# EAGLE design NT_SolarModule (EAGLE 9.5.1)
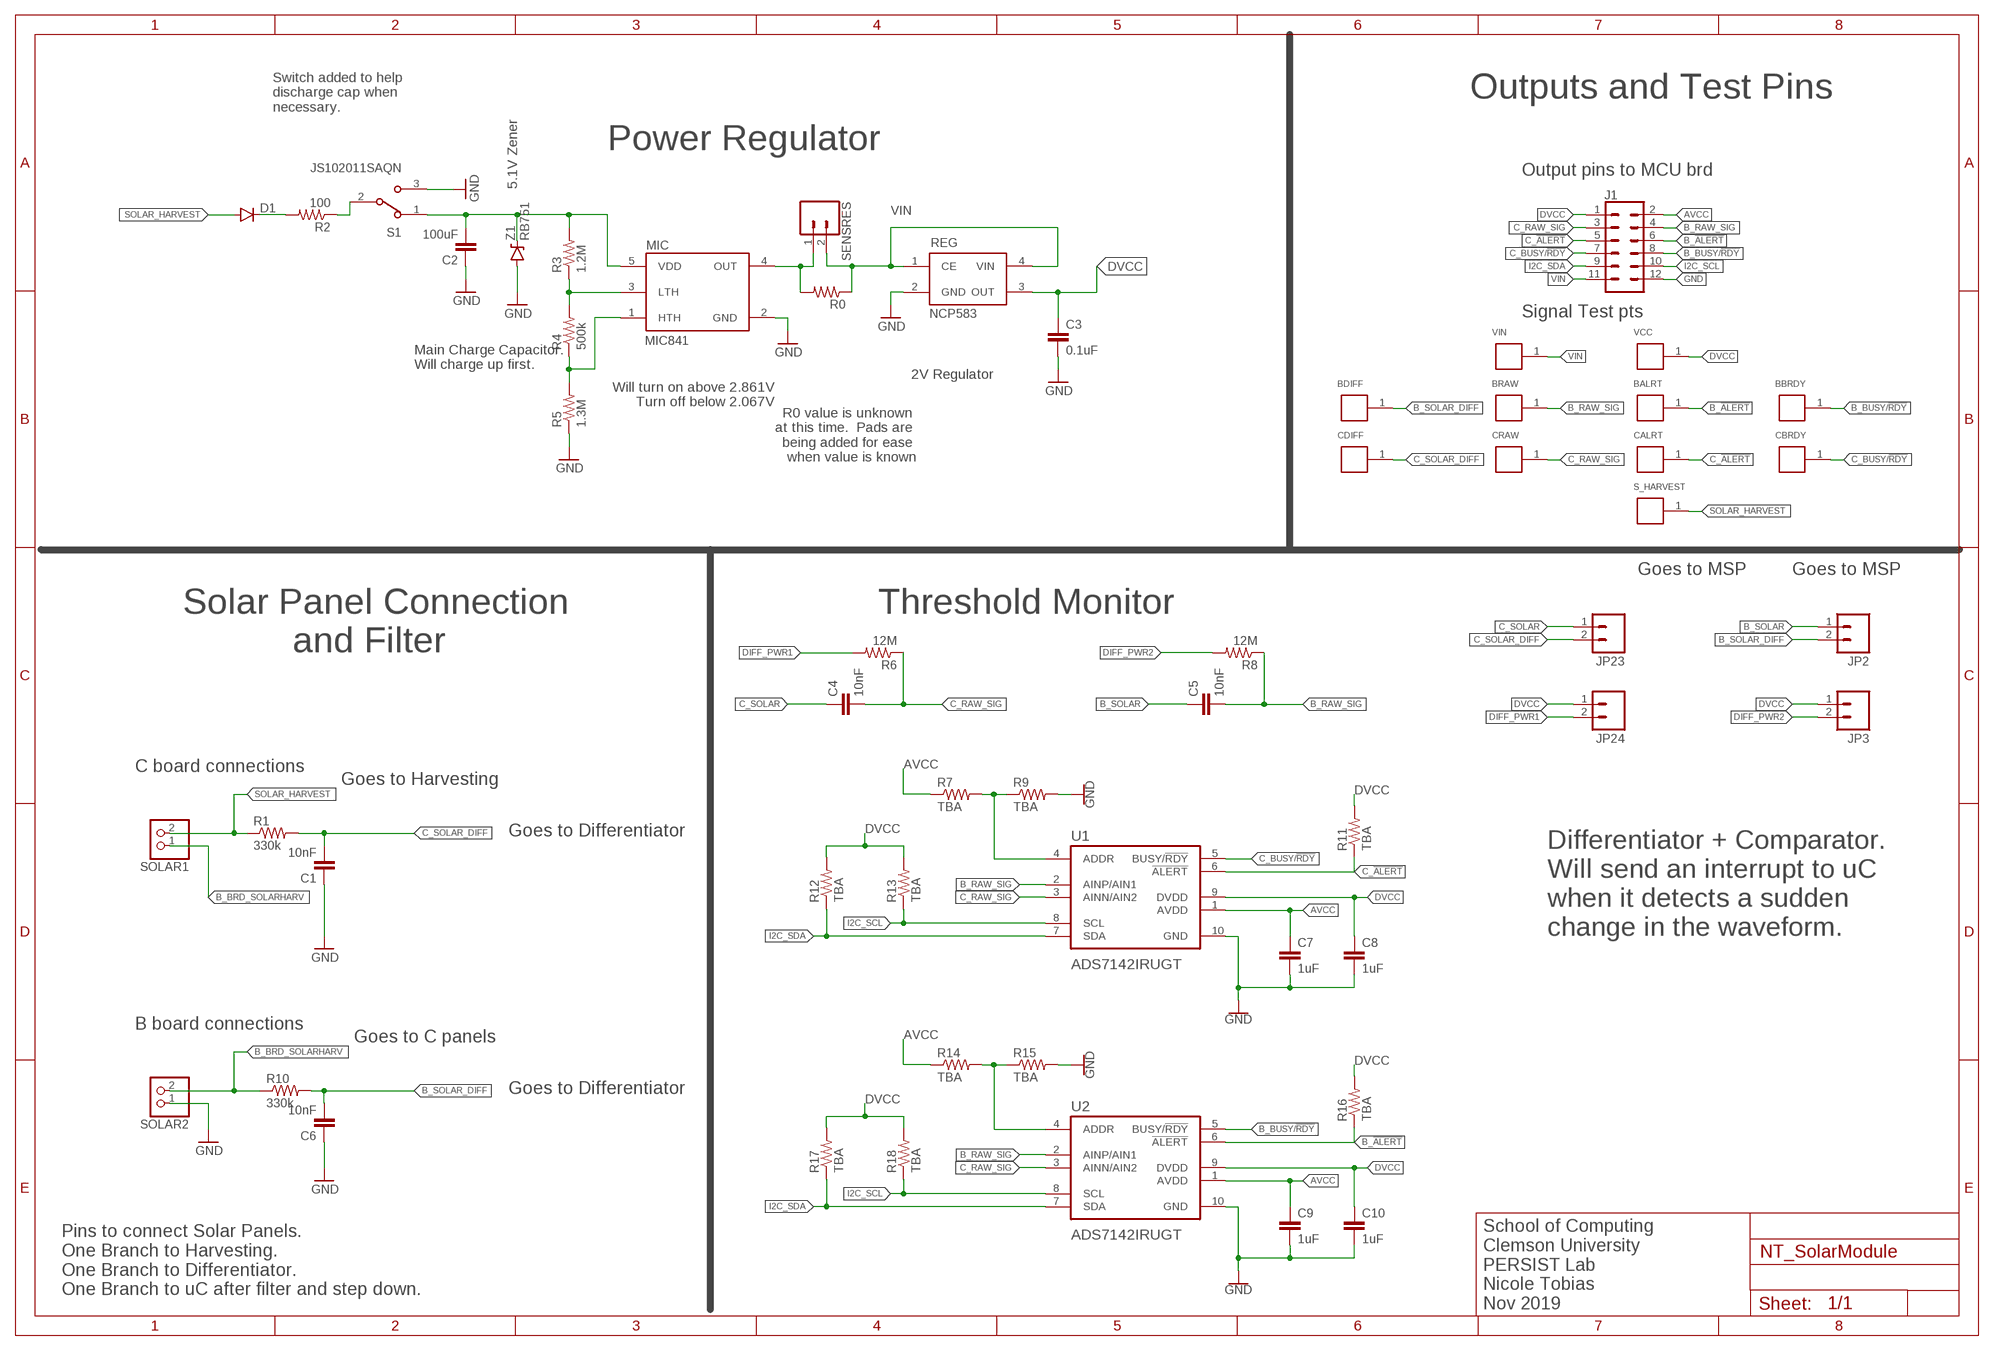
[diagram p0: schematic, sheet 1]

## Parts
BALRT  RCU-0C  [TE_RCU-0C]
BBRDY  RCU-0C  [TE_RCU-0C]
BDIFF  RCU-0C  [TE_RCU-0C]
BRAW  RCU-0C  [TE_RCU-0C]
C1  10nF  CAP0603-CAP  [0603-CAP]
C2  100uF  CAP0603-CAP  [0603-CAP]
C3  0.1uF  CAP0603-CAP  [0603-CAP]
C4  10nF  CAP0603-CAP  [0603-CAP]
C5  10nF  CAP0603-CAP  [0603-CAP]
C6  10nF  CAP0603-CAP  [0603-CAP]
C7  1uF  CAP0603-CAP  [0603-CAP]
C8  1uF  CAP0603-CAP  [0603-CAP]
C9  1uF  CAP0603-CAP  [0603-CAP]
C10  1uF  CAP0603-CAP  [0603-CAP]
CALRT  RCU-0C  [TE_RCU-0C]
CBRDY  RCU-0C  [TE_RCU-0C]
CDIFF  RCU-0C  [TE_RCU-0C]
CRAW  RCU-0C  [TE_RCU-0C]
D1  DIODESOD523  [SOD523]
J1  2X6 FEMALE  CONN_06X2PTH_FEMALE  [2X6]
JP2  M02  [1X02-1.27MM]
JP3  M02  [1X02-1.27MM]
JP23  M02  [1X02-1.27MM]
JP24  M02  [1X02-1.27MM]
MIC  MIC841  [SC70-5]
R0  RESISTOR0603  [0603-RES]
R1  330k  RESISTOR0603  [0603-RES]
R2  100  RESISTOR0603  [0603-RES]
R3  1.2M  RESISTOR0603  [0603-RES]
R4  500k  RESISTOR0603  [0603-RES]
R5  1.3M  RESISTOR0603  [0603-RES]
R6  12M  RESISTOR0603  [0603-RES]
R7  TBA  RESISTOR0603  [0603-RES]
R8  12M  RESISTOR0603  [0603-RES]
R9  TBA  RESISTOR0603  [0603-RES]
R10  330k  RESISTOR0603  [0603-RES]
R11  TBA  RESISTOR0603  [0603-RES]
R12  TBA  RESISTOR0603  [0603-RES]
R13  TBA  RESISTOR0603  [0603-RES]
R14  TBA  RESISTOR0603  [0603-RES]
R15  TBA  RESISTOR0603  [0603-RES]
R16  TBA  RESISTOR0603  [0603-RES]
R17  TBA  RESISTOR0603  [0603-RES]
R18  TBA  RESISTOR0603  [0603-RES]
REG  NCP583  [SC82-AB_1PRIMARY]
S1  JS102011SAQN  [SW_JS102011SAQN]
S_HARVEST  RCU-0C  [TE_RCU-0C]
SENSRES  CONN_02  [1X02]
SOLAR1  PINHD-1X2  [1X02]
SOLAR2  PINHD-1X2  [1X02]
U1  ADS7142IRUGT  [QFN50P200X150X40-10N]
U2  ADS7142IRUGT  [QFN50P200X150X40-10N]
VCC  RCU-0C  [TE_RCU-0C]
VIN  RCU-0C  [TE_RCU-0C]
Z1  RB751  DIODE-ZENER  [SOD-523]

## Nets
AVCC: C7.1 C9.1 J1.2 R7.1 R14.1 U1.1(AVDD) U2.1(AVDD)
B_!ALERT: BALRT.1 J1.6 R16.1 U2.6(!ALERT)
B_BRD_SOLARHARV: R10.1 SOLAR1.1 SOLAR2.2
B_BUSY/!RDY: BBRDY.1 J1.8 U2.5(BUSY/!RDY)
B_RAW_SIG: BRAW.1 C5.2 J1.4 R8.1 U1.2(AINP/AIN1) U2.2(AINP/AIN1)
B_SOLAR: C5.1 JP2.1
B_SOLAR_DIFF: BDIFF.1 C6.2 JP2.2 R10.2
C_!ALERT: CALRT.1 J1.5 R11.1 U1.6(!ALERT)
C_BUSY/!RDY: CBRDY.1 J1.7 U1.5(BUSY/!RDY)
C_RAW_SIG: C4.2 CRAW.1 J1.3 R6.1 U1.3(AINN/AIN2) U2.3(AINN/AIN2)
C_SOLAR: C4.1 JP23.1
C_SOLAR_DIFF: C1.2 CDIFF.1 JP23.2 R1.2
DIFF_PWR1: JP24.2 R6.2
DIFF_PWR2: JP3.2 R8.2
DVCC: C3.1 C8.1 C10.1 J1.1 JP3.1 JP24.1 R11.2 R12.2 R13.2 R16.2 R17.2 R18.2 REG.3(OUT) U1.9(DVDD) U2.9(DVDD) VCC.1
GND: C1.1 C2.1 C3.2 C6.1 C7.2 C8.2 C9.2 C10.2 J1.12 MIC.2(GND) R5.1 R9.2 R15.2 REG.2(GND) S1.3 SOLAR2.1 U1.10(GND) U2.10(GND) Z1.ANODE(A)
I2C_SCL: J1.10 R13.1 R18.1 U1.8(SCL) U2.8(SCL)
I2C_SDA: J1.9 R12.1 R17.1 U1.7(SDA) U2.7(SDA)
MIC_INPUT: C2.2 MIC.5(VDD) R3.2 S1.1 Z1.CATHODE(C)
N$1: D1.C R2.2
N$2: R7.2 R9.1 U1.4(ADDR)
N$3: MIC.4(OUT) R0.2 SENSRES.1
N$4: R14.2 R15.1 U2.4(ADDR)
N$6: R2.1 S1.2
N$11: MIC.3(LTH) R3.1 R4.2
N$12: MIC.1(HTH) R4.1 R5.2
SOLAR_HARVEST: D1.A R1.1 S_HARVEST.1 SOLAR1.2
VIN: J1.11 R0.1 REG.1(CE) REG.4(VIN) SENSRES.2 VIN.1

## Notes on the sheet
- Outputs and Test Pins
- Switch added to help 
  discharge cap when 
  necessary.
- Power Regulator
- Output pins to MCU brd
- 5.1V Zener
- Signal Test pts
- Main Charge Capacitor.
  Will charge up first.
- 2V Regulator
- Will turn on above 2.861V
  Turn off below 2.067V
- R0 value is unknown 
  at this time.  Pads are 
  being added for ease 
  when value is known
- Goes to MSP | Goes to MSP
- Threshold Monitor
- Solar Panel Connection
             and Filter
- C board connections
- Goes to Harvesting
- Goes to Differentiator
- Differentiator + Comparator.
  Will send an interrupt to uC 
  when it detects a sudden 
  change in the waveform.
- B board connections
- Goes to C panels
- Goes to Differentiator
- Pins to connect Solar Panels.
  One Branch to Harvesting.
  One Branch to Differentiator.
  One Branch to uC after filter and step down.
- School of Computing
  Clemson University
  PERSIST Lab
  Nicole Tobias
  Nov 2019

## Library data of the parts
BALRT BBRDY BDIFF BRAW CALRT CBRDY CDIFF CRAW S_HARVEST VCC VIN = RCU-0C:RCU-0C: 0603 PROBE PAD; AVAILABILITY: Unavailable; COMMENT: RCU-0C _1625854-3_; DESCRIPTION: 0603 PROBE PAD; EU_ROHS_COMPLIANCE: Compliant; LINK: http://www.te.com/usa-en/product-1625854-3.html; MF: TE Connectivity; MP: RCU-0C; PACKAGE: 0603; POWER_RATING: 0 W; PRICE: None; RESISTANCE: <.05; TOLERANCE: 0%
C1-C10 = SparkFun-Capacitors:CAP: Capacitor Standard 0603 ceramic capacitor, and 0.1" leaded capacitor.
D1 = SparkFun-DiscreteSemi:DIODE: Diode These are standard reverse protection diodes and small signal diodes. SMA package can handle up to about 1A. SOD-323 can handle about 200mA. What the SOD-323 package when ordering, there are some mfgs out there that are 5-pin packages.
J1 = SparkFun-Connectors:CONN_06X2: Multi connection point. Often used as Generic Header-pin footprint for 0.1 inch spaced/style header connections On any of the 0.1 inch spaced packages, you can populate with these: Break Away Headers - Straight <https://www.sparkfun.com/products/116> (PRT-00116) Break Away Male Headers - Right Angle <https://www.sparkfun.com/products/553> (PRT-00553) Female Headers <https://www.sparkfun.com/products/115> (PRT-00115) Break Away Headers - Machine Pin <https://www.sparkfun.com/products/117> (PRT-00117) Break Away Female Headers - Swiss Machine Pin <https://www.sparkfun.com/products/743> (PRT-00743); PROD_ID: CONN-12423
JP2 JP3 JP23 JP24 = SparkFun-Connectors:M02: Standard 2-pin 0.1" header. Use with - straight break away headers ( PRT-00116) - right angle break away headers (PRT-00553) - swiss pins (PRT-00743) - machine pins (PRT-00117) - female headers (PRT-00115) Molex polarized connector foot print use with: PRT-08233 with associated crimp pins and housings. 2.54_SCREWTERM for use with PRT-10571. 3.5mm Screw Terminal footprints for PRT-08084 5mm Screw Terminal footprints for use with PRT-08432
MIC = mic841:MIC841: MIC841:Comparator with reference and adj. hysteresis
R0 R1-R18 = SparkFun-Resistors:RESISTOR: Resistor Basic schematic elements and footprints for 0603, 1206, and PTH resistors.
REG = ncp583:NCP583: NCP583 - Ultra-Low Iq 150 mA CMOS LDO Regulator with Enable The NCP583 series of low dropout regulators are designed for portable battery powered applications which require precise output voltage accuracy and low quiescent current. These devices feature an enable function which lowers current consumption significantly and are offered in two small packages; SC−82AB and the SOT−563. A 1.0 mF ceramic capacitor is the recommended value to be used with these devices on the output pin.
S1 = JS102011SAQN:JS102011SAQN: JS10 Series SPDT On-On 6 V 0.3 A Gull Wing SMT Slide Switch http://www.snapeda.com/parts/JS102011SAQN/C%26K%20Components/view-part/; AVAILABILITY: Good; DESCRIPTION: SWITCH SLIDE SPDT 300MA 6V; MF: C&K Components; MP: JS102011SAQN; PACKAGE: None; PRICE: 0.35 USD
SENSRES = SparkFun-Connectors:CONN_02: Multi connection point. Often used as Generic Header-pin footprint for 0.1 inch spaced/style header connections On any of the 0.1 inch spaced packages, you can populate with these: Break Away Headers - Straight <https://www.sparkfun.com/products/116> (PRT-00116) Break Away Male Headers - Right Angle <https://www.sparkfun.com/products/553> (PRT-00553) Female Headers <https://www.sparkfun.com/products/115> (PRT-00115) Break Away Headers - Machine Pin <https://www.sparkfun.com/products/117> (PRT-00117) Break Away Female Headers - Swiss Machine Pin <https://www.sparkfun.com/products/743> (PRT-00743) For SCREWTERMINALS and SPRING TERMINALS visit here: Screw Terimnals on SparkFun.com <https://www.sparkfun.com/search/results?term=Screw+Terminals> (5mm/3.5mm/2.54mm spacing) This device is also useful as a general connection point to wire up your design to another part of your project. Our various solder wires solder well into these plated through hole pads. Hook-Up Wire - Assortment (Stranded, 22 AWG) <https://www.sparkfun.com/products/11375> (PRT-11375) Hook-Up Wire - Assortment (Solid Core, 22 AWG) <https://www.sparkfun.com/products/11367> (PRT-11367) View the entire wire category on our website here <https://www.sparkfun.com/categories/141> Special notes: Molex polarized connector foot print use with: PRT-08233 with associated crimp pins and housings. 2.54_SCREWTERM for use with PRT-10571. 3.5mm Screw Terminal footprints for PRT-08084 5mm Screw Terminal footprints for use with PRT-08432
SOLAR1 SOLAR2 = pinhead:PINHD-1X2: PIN HEADER
U1 U2 = ADS7142IRUGT:ADS7142IRUGT: None; AVAILABILITY: Unavailable; DESCRIPTION: Dual Channel Single ADC SAR 140ksps 16-bit Serial 10-Pin X2QFN T/R; MF: Texas Instruments; MP: ADS7142IRUGT; PACKAGE: XFQFN-10 Texas Instruments; PRICE: None
Z1 = Parts:DIODE-ZENER: Zener Diode Production Part - 8199 3.4V Zener Voltage

## Board
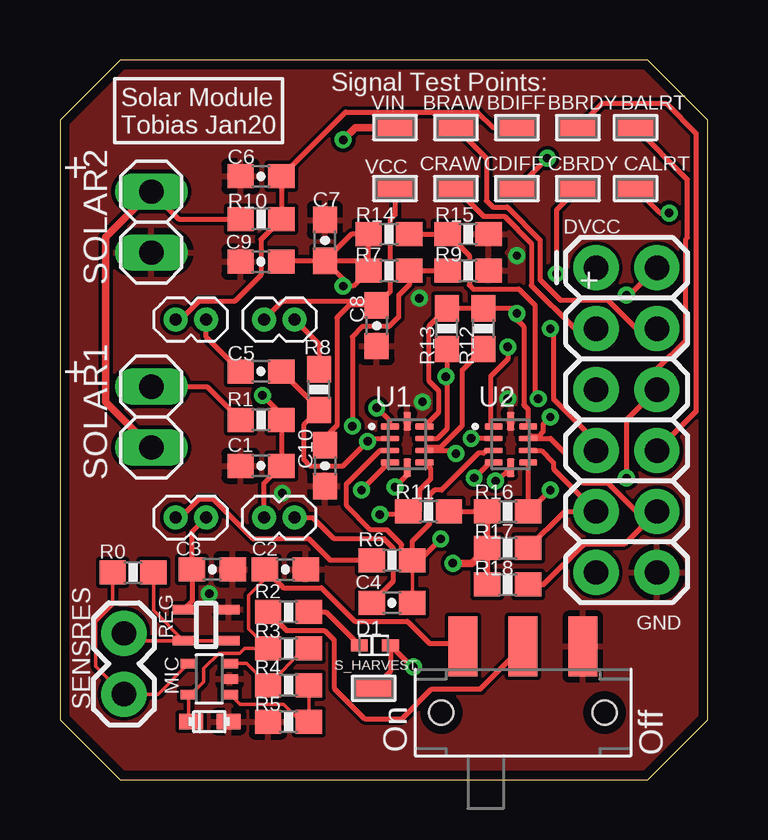
[diagram p1: board, top side]
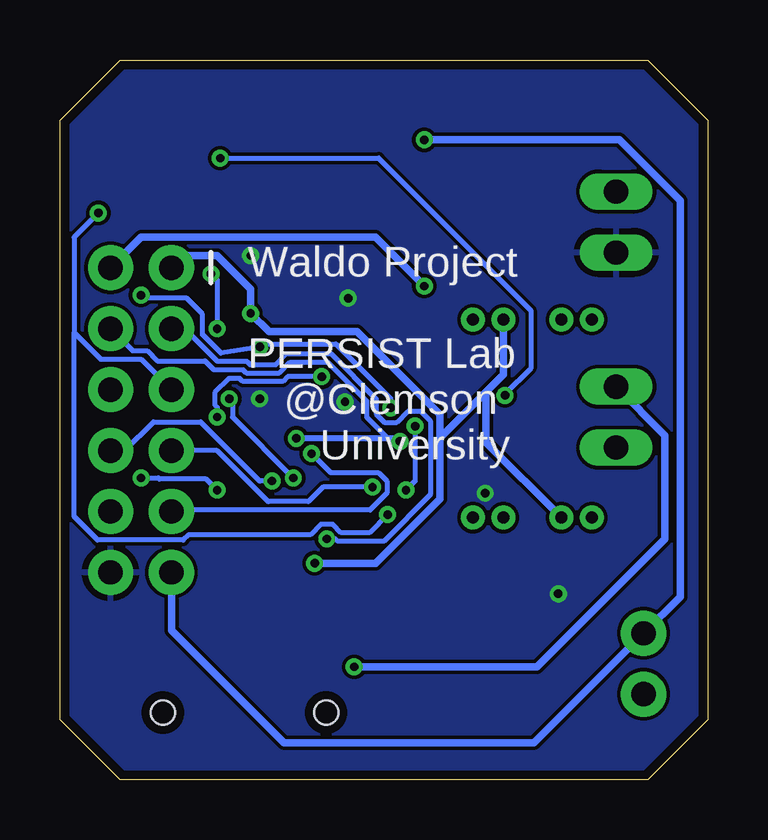
[diagram p2: board, bottom side, seen from below]

Size 27 x 30 mm. Coordinates in mm from the lower left corner, seen from the top.
Outline: 2.5,0 24.5,0 27,2.5 27,27.5 24.5,30 2.5,30 0,27.5 0,2.5 2.5,0
Copper layers (1*16): Top 0.0356mm / dielectric 1.5011mm / Bottom 0.0356mm
Design rules "oshpark-2layer": minimum track width 6mil, minimum drill 13mil, track to track 6mil, track to pad 6mil, pad to pad 6mil, via to via 6mil, smd to smd 6mil, copper to edge 15mil, drill to drill 6mil, minimum pad ring 7mil, minimum via ring 7mil, stop-mask expansion 2.5mil, vias tented up to drill 0mil, thermal gap 10mil

### Footprints (pad centres in the part's own frame; a part is rotated, then mirrored left to right if it is on the bottom)
TE_RCU-0C = smd 1.6 x 0.8: 1 0,0
0603-CAP = smd 1.1 x 1: 1 -0.85,0; 2 0.85,0
SOD523 = smd 0.7 x 0.5: A 0.7,0; C -0.6,0
2X6 = drill 1.016 pad 1.88: 1 0,0; 2 0,2.54; 3 2.54,0; 4 2.54,2.54; 5 5.08,0; 6 5.08,2.54; 7 7.62,0; 8 7.62,2.54; 9 10.16,0; 10 10.16,2.54; 11 12.7,0; 12 12.7,2.54
1X02-1.27MM = drill 0.508 pad 1: 1 0,0; 2 1.27,0
SC70-5 = smd 0.4 x 0.7: 1 -0.65,-0.85; 2 0,-0.85; 3 0.65,-0.85; 4 0.65,0.85; 5 -0.65,0.85
0603-RES = smd 1.1 x 1: 1 -0.85,0; 2 0.85,0
SC82-AB_1PRIMARY = smd 0.406 x 0.914: 1 -1.321,-0.813; 2 -0.025,-0.813; 3 -0.025,1.067; 4 -1.321,1.067
SW_JS102011SAQN = smd 1.2 x 2.5: 1 -2.5,2.75; 2 0,2.75; 3 2.5,2.75 | hole 1: -3.4,0; 3.4,0
1X02 = drill 1.016 pad 1.88: 1 0,0; 2 2.54,0
1X02' = drill 1.016 long: 1 -1.27,0; 2 1.27,0
QFN50P200X150X40-10N = smd 0.76 x 0.27: 1 -0.72,0.75; 4 -0.72,-0.75; 6 0.72,-0.75; 9 0.72,0.75 | smd 0.76 x 0.22: 2 -0.72,0.25; 3 -0.72,-0.25; 7 0.72,-0.25; 8 0.72,0.25 | smd 0.32 x 0.76: 5 0,-0.97; 10 0,0.97
SOD-523 = smd 1 x 0.635: ANODE -0.8,0; CATHODE 0.76,0

### Placement (x,y rotation side)
BALRT  24,27.18 0 top
BBRDY  21.59,27.18 0 top
BDIFF  19.05,27.18 0 top
BRAW  16.51,27.18 0 top
C1  8.38,13.08 0 top
C2  9.4,8.76 180 top
C3  6.35,8.76 0 top
C4  13.84,7.37 0 top
C5  8.38,17.02 0 top
C6  8.38,25.15 0 top
C7  11.05,22.48 90 top
C8  13.21,18.92 270 top
C9  8.38,21.59 180 top
C10  11.05,13.08 270 top
CALRT  24,24.64 0 top
CBRDY  21.59,24.64 0 top
CDIFF  19.05,24.64 0 top
CRAW  16.51,24.64 0 top
D1  13.08,5.59 0 top
J1  22.35,21.34 270 top
JP2  6.1,19.18 180 top
JP3  8.51,19.18 0 top
JP23  9.78,10.92 180 top
JP24  6.1,10.92 180 top
MIC  6.22,4.19 90 top
R0  3.05,8.64 180 top
R1  8.38,14.99 0 top
R2  9.53,6.99 0 top
R3  9.53,5.46 180 top
R4  9.53,3.94 180 top
R5  9.53,2.41 0 top
R6  13.84,9.14 180 top
R7  13.72,21.21 0 top
R8  10.79,16.26 90 top
R9  17.02,21.21 0 top
R10  8.38,23.37 0 top
R11  15.37,11.18 0 top
R12  17.65,18.8 90 top
R13  16.13,18.8 90 top
R14  13.72,22.73 0 top
R15  17.02,22.73 0 top
R16  18.67,11.18 180 top
R17  18.67,9.65 180 top
R18  18.67,8.13 180 top
REG  6.22,7.11 90 top
S1  19.3,2.79 0 top
S_HARVEST  13.08,3.81 0 top
SENSRES  2.67,3.56 90 top
SOLAR1  [1X02']  3.81,15.11 90 top
SOLAR2  [1X02']  3.81,23.24 90 top
U1  14.48,13.97 0 top
U2  18.8,13.97 0 top
VCC  13.97,24.64 0 top
VIN  13.97,27.18 0 top
Z1  6.22,2.41 180 top

### Tracks (layer width: path | path; a pad name or v marks a point on that pad's centre or on a via)
AVCC  (via drill 0.35)
  Top 0.152: C9.1 9.27,21.63
  Top 0.2: 9.27,21.63 C7.1 | C7.1 12.45,21.63 R7.1 | R7.1 R14.1 12.15,22.73 C7.1 | C7.1 11.81,20.87 v11.81,20.57 12.23,20.57 R7.1 | U1.1 13.76,14.94 v13.21,15.49 | v18.67,18.03 18.67,17.53 17.95,16.81 17.95,14.85 U2.1 | J1.2 23.75,20.19 v23.62,20.19
  Bottom 0.2: v23.62,20.19 23.5,20.07 21.72,20.07 21.05,19.4 21.05,18.55 20.29,17.78 v18.67,18.03 18.54,18.16 15.49,18.16 13.21,15.88 v13.21,15.49
  Bottom 0.305: J1.2 23.62,22.61 13.84,22.61 v11.81,20.57
B_!ALERT  (via drill 0.35)
  Top 0.2: U2.6 R16.1 19.56,11.18 v20.45,12.06 | BALRT.1 26.16,25.02 26.16,22.61 26.08,22.53 26.08,18.3 24.89,17.11 J1.6 23.62,14.99 v23.62,12.57
  Bottom 0.2: v20.45,12.06 20.91,12.52 22.85,12.52 22.89,12.57 v23.62,12.57
B_BRD_SOLARHARV
  Top 0.2: SOLAR2.2 4.95,23.37 R10.1
  Top 0.305: SOLAR2.2 1.91,22.61 1.91,15.75 SOLAR1.1
B_BUSY/!RDY  (via drill 0.35)
  Top 0.2: U2.5 18.24,12.45 v18.16,12.45 | BBRDY.1 22.61,28.19 25.27,28.19 26.52,26.95 26.52,15.34 J1.8
  Bottom 0.2: v18.16,12.45 18.67,12.45 21.13,14.91 23.1,14.91 24.29,13.72 J1.8
B_RAW_SIG  (via drill 0.35)
  Top 0.2: C5.2 10.79,15.46 R8.1 10.16,14.77 10.16,13.34 10.41,13.08 11.81,13.08 v12.83,14.1 12.95,14.22 U1.2 | BRAW.1 17.78,25.91 17.78,24.13 18.04,23.87 18.65,23.87 20.02,22.5 20.02,20.84 20.87,19.99 22.85,19.99 24.04,18.8 J1.4 | U2.2 v17.15,14.22 v17.14,14.22
  Bottom 0.2: J1.4 23.97,17.88 23.37,17.88 22.94,17.45 20.95,17.45 20.58,17.07 19.36,17.07 19.23,16.95 17.85,16.95 17.4,17.4 15.84,17.4 14.21,15.77 14.21,15.11 13.32,14.22 12.95,14.22
  Bottom 0.254: v12.83,14.1 12.95,14.22 v17.14,14.22
B_SOLAR
  Top 0.2: C5.1 6.1,18.45 JP2.1
B_SOLAR_DIFF
  Top 0.2: JP2.2 5.03,19.18 5.78,19.93 7.28,19.93 8.38,21.03 8.38,22.52 R10.2 C6.2 11.92,27.83 17.41,27.83 18.07,27.18 BDIFF.1
C_!ALERT  (via drill 0.35)
  Top 0.2: U1.6 15.45,12.97 15.45,12.53 14.99,12.06 14.99,11.18 R11.1 14.39,11.05 v13.34,11.05 | CALRT.1 25.02,23.62 v25.4,23.62
  Bottom 0.2: v25.4,23.62 26.42,22.61 26.42,18.63 | v13.34,11.05 14.1,10.29 15.27,10.29 15.62,10.64 16.13,10.64 16.56,10.21 21.64,10.21 21.86,9.98 25.43,9.98 26.42,10.97 26.42,18.63 | 26.42,18.63 25.31,17.52 23.62,17.52 J1.5
C_BUSY/!RDY  (via drill 0.35)
  Top 0.2: U1.5 14.48,12.7 v13.97,12.19 | CBRDY.1 20.7,23.75 v20.7,21.08 | J1.7 22.35,14.1 20.57,15.88 20.57,18.67 v20.45,18.8
  Bottom 0.2: v13.97,12.19 16.04,12.19 16.64,11.59 18.32,11.59 20.45,13.72 J1.7 | v20.7,21.08 20.45,20.83 v20.45,18.8
C_RAW_SIG  (via drill 0.35)
  Top 0.152: R6.1 C4.2
  Top 0.2: R6.1 14.24,9.59 14.24,9.8 13.63,10.41 12.95,10.41 11.94,11.43 11.94,12.32 13.34,13.72 U1.3 | R6.1 14.69,9.95 15.41,10.67 15.41,11.86 15.62,12.06 15.91,12.06 17.45,13.61 17.67,13.61 17.78,13.72 U2.3 | CRAW.1 17.66,23.48 18.52,23.48 19.66,22.35 19.66,20.6 21.46,18.8 J1.3 | v15.88,10.03 14.99,9.14 R6.1
  Bottom 0.2: J1.3 21.8,18.8 20.43,17.43 19.21,17.43 19.08,17.3 18,17.3 17.55,17.75 15.69,17.75 13.81,15.87 13.81,15.24 13.46,14.89 12.96,14.89 12.51,15.34 11.94,15.34 11.56,14.95 11.56,11.88 13.5,9.94 15.42,9.94 15.52,10.03 v15.88,10.03
C_SOLAR
  Top 0.2: JP23.1 10.54,10.92 11.43,10.03 13.51,10.03 13.89,9.65 13.89,8.26 C4.1
C_SOLAR_DIFF  (via drill 0.35)
  Top 0.2: JP23.2 8.51,12.36 C1.2 R1.2 9.23,15.23 v8.45,16.01 | v20.32,25.91 CDIFF.1
  Bottom 0.2: v20.32,25.91 13.72,25.91 7.37,19.56 7.37,17.14 8.45,16.07 v8.45,16.01
DIFF_PWR1
  Top 0.2: R6.2 11.27,9.14 10.39,10.02 8.06,10.02 6.41,11.67 5.78,11.67 5.03,10.92 JP24.2
DIFF_PWR2
  Top 0.2: JP3.2 10.79,18.16 R8.2
DVCC  (via drill 0.35)
  Top 0.2: JP3.1 9.27,19.94 13.04,19.94 C8.1 | VCC.1 13.97,23.54 13.76,23.34 13.76,20.33 C8.1 | R11.2 R16.2 R17.2 R18.2 | JP24.1 5.5,10.33 C3.1 5.5,7.43 REG.3 | C8.1 12.06,19.77 11.55,19.25 11.55,14.75 11.05,14.25 C10.1 | U2.9 19.52,15.44 19.33,15.62 19.33,18.89 19.05,19.18 v19.05,19.43 18.84,19.65 R12.2 R13.2 15.37,18.88 15.37,16.64 15.78,16.23 15.78,15.3 U1.9
  Top 0.305: R17.2 17.18,9.02 v16.38,9.02
  Bottom 0.305: J1.1 21.84,21.84 20.45,21.84 19.05,20.45 v19.05,19.43 18.29,18.67 14.61,18.67 11.15,15.22 11.15,14.24 | JP3.1 8.51,16.88 9.23,16.16 | 9.23,16.16 9.23,14.06 JP24.1 | v16.38,9.02 13.84,9.02 11.15,11.71 11.15,14.24 | 9.23,16.16 11.15,14.24
GND  (via drill 0.35)
  other vias: 6.22,7.75 9.27,11.94 14.99,20.07 19.05,21.84 15.11,15.75 18.67,15.88
  pour Top: -2.54,33.02 27.94,33.02 27.94,-3.81 -2.54,-3.81
  pour Bottom: -3.81,31.75 29.21,31.75 29.21,-3.81 -3.81,-3.81
I2C_SCL  (via drill 0.35)
  Top 0.2: R18.1 20.16,8.13 21.86,9.83 23.54,9.83 J1.10 24.04,11.18 22.85,12.37 21.8,12.37 21.08,13.08 21.08,13.59 20.45,14.22 U2.8 19.63,14.33 19.98,14.33 20.15,14.5 20.15,14.81 v20.45,15.11 | U1.8 15.75,14.22 16.13,14.61 16.13,16.75 v16.09,16.79 16.13,16.83 R13.1
  Bottom 0.2: v16.09,16.79 17.51,16.79 17.7,16.6 19.38,16.6 19.51,16.72 19.95,16.72 20.54,16.13 20.54,15.62 20.45,15.53 v20.45,15.11
I2C_SDA  (via drill 0.35)
  Top 0.2: R17.1 21.04,11.18 J1.9 20.57,12.95 20.57,13.21 20.07,13.72 U2.7 | R12.1 16.76,17.06 16.76,14.74 15.88,13.86 15.34,13.86 U1.7 16.38,13.72 v16.51,13.59
  Bottom 0.2: v16.51,13.59 15.72,12.8 13.72,12.8 13.37,12.44 13.37,11.94 14.07,11.23 22.29,11.23 J1.9
MIC_INPUT
  Top 0.152: C2.2 8.5,8.31 7.87,7.68 7.87,6.29 8.67,5.49 R3.2 7.69,5.46 7.5,5.27 6.63,5.27 5.99,4.63 5.99,4.08 5.41,3.5 MIC.5 5.37,2.5 Z1.CATHODE | 16.8,5.67 S1.1
  Top 0.2: C2.2 9.32,7.99 10.9,7.99 12.3,6.6 14.49,6.6 15.41,5.67 16.8,5.67
N$1
  Top 0.2: R2.2 11.08,6.99 D1.C
N$2  (via drill 0.35)
  Top 0.2: R9.1 R7.2 14.57,20.63 14.12,20.18 14.12,19.27 13.72,18.88 12.6,18.88 12.19,18.46 v12.19,14.73 | U1.4 13.73,13.22 v12.57,12.06
  Bottom 0.2: v12.57,12.06 12.19,12.45 v12.19,14.73
N$3
  Top 0.152: R0.2 2.2,7.28 1.5,6.58 1.5,4.72 SENSRES.1 4.09,3.56 MIC.4
N$4  (via drill 0.35)
  Top 0.2: R14.2 R15.1 17.07,21.84 17.07,20.6 17.21,20.46 19.13,20.46 19.81,19.78 19.81,16 v19.94,15.88 | U2.4 18.06,13.21 17.91,13.21 v17.27,12.57
  Bottom 0.2: v17.27,12.57 19.81,15.11 19.81,15.75 v19.94,15.88
N$6
  Top 0.2: R2.1 9.45,6.21 11.03,6.21 11.43,5.81 11.43,3.81 12.7,2.54 14.26,2.54 15.5,3.77 17.54,3.77 S1.2
N$11
  Top 0.152: MIC.3 7.77,4.84 R4.2 10.2,5.46 R3.1
N$12
  Top 0.152: MIC.1 7.09,3.56 7.5,3.14 9.32,3.14 10.05,2.41 R5.2 R4.1
SOLAR_HARVEST  (via drill 0.35)
  Top 0.2: S_HARVEST.1 13.78,4.51 D1.A 14.67,4.7 v14.73,4.7 | SOLAR1.2 6.13,16.38 R1.1
  Bottom 0.305: SOLAR1.2 1.78,14.35 1.78,10.03 7.11,4.7 v14.73,4.7
VIN  (via drill 0.35)
  Top 0.152: REG.1 REG.4 | R0.1 3.9,7.05 REG.4 | REG.4 2.97,5.79 SENSRES.2
  Top 0.305: VIN.1 12.32,27.18 v11.81,26.67
  Bottom 0.305: J1.11 22.35,6.22 17.65,1.52 7.24,1.52 SENSRES.2 1.14,7.62 1.14,24.13 3.68,26.67 v11.81,26.67

### Text on the board
tPlace: Signal Test Points: | Solar Module / Tobias Jan20 | + | DVCC | + | + | GND | On | Off
bPlace: Waldo Project / / PERSIST Lab / @Clemson / University